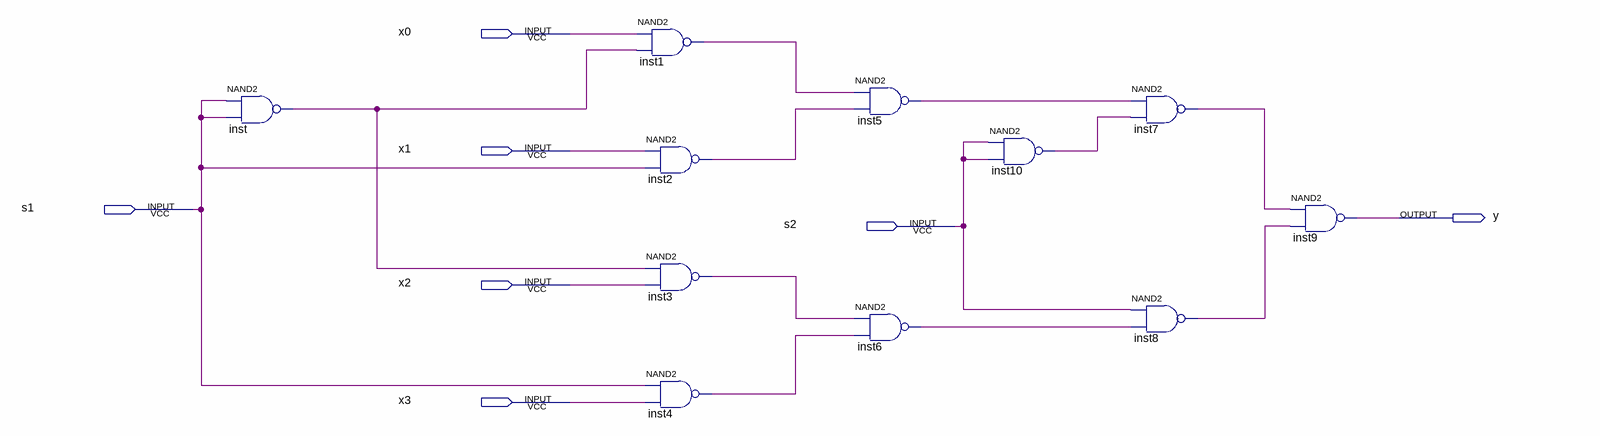
[diagram p0: schematic sheet]
// Quartus schematic Problema44.bdf as structural Verilog: 11 symbols, 7 pins
module Problema44 (
  input  x0,
  input  x1,
  input  s1,
  input  s2,
  input  x2,
  input  x3,
  output y
);

  wire inst1_out, inst2_out, inst3_out, inst4_out, inst5_out, inst6_out, inst7_out, inst8_out, inst10_out,
       inst_out;

  nand inst (inst_out, s1, s1);
  nand inst1 (inst1_out, x0, inst_out);
  nand inst2 (inst2_out, x1, s1);
  nand inst3 (inst3_out, inst_out, x2);
  nand inst4 (inst4_out, s1, x3);
  nand inst5 (inst5_out, inst1_out, inst2_out);
  nand inst6 (inst6_out, inst3_out, inst4_out);
  nand inst10 (inst10_out, s2, s2);
  nand inst7 (inst7_out, inst5_out, inst10_out);
  nand inst8 (inst8_out, s2, inst6_out);
  nand inst9 (y, inst7_out, inst8_out);
endmodule
